# EAGLE design uav (EAGLE 5.07)
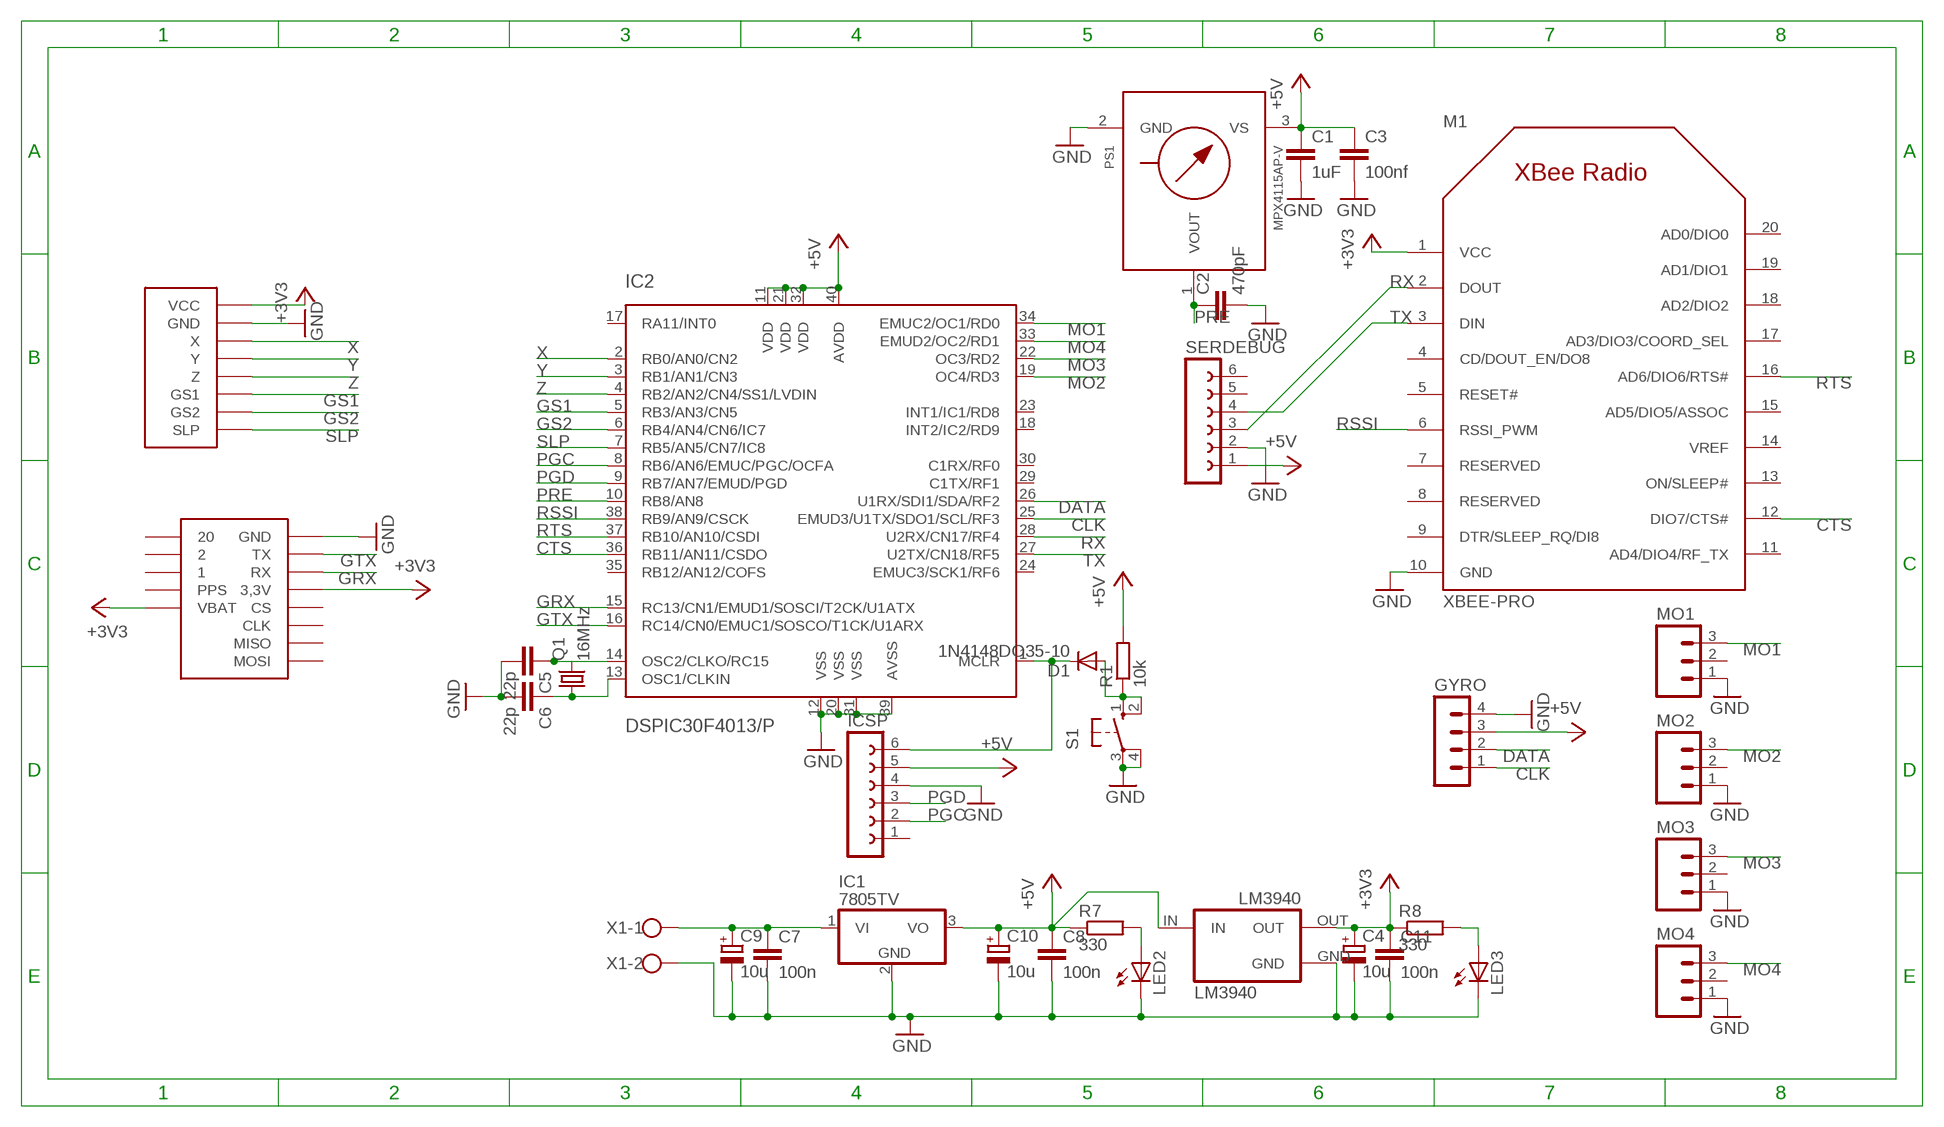
[diagram p0: schematic, sheet 1]

## Parts
C1  1uF  C-EU050-025X075  [C050-025X075]
C2  470pF  C-EU050-025X075  [C050-025X075]
C3  100nf  C-EU050-025X075  [C050-025X075]
C4  10u  CPOL-EUB45181B  [B45181B]
C5  22p  C-EU050-025X075  [C050-025X075]
C6  22p  C-EU050-025X075  [C050-025X075]
C7  100n  C-EU050-025X075  [C050-025X075]
C8  100n  C-EU050-025X075  [C050-025X075]
C9  10u  CPOL-EUB45181A  [B45181A]
C10  10u  CPOL-EUB45181A  [B45181A]
C11  100n  C-EU050-025X075  [C050-025X075]
D1  1N4148DO35-10  [DO35-10]
GYRO  MA04-1  [MA04-1]
IC1  7805TV  [TO220V]
IC2  DSPIC30F4013/P  [DIL40]
ICSP  FE06-1  [FE06]
LED2  LED3MM  [LED3MM]
LED3  LED3MM  [LED3MM]
LM3940  LM3940  [TO220(V)]
M1  XBEE-PRO  [XBEE-PRO]
MO1  M03  [03P]
MO2  M03  [03P]
MO3  M03  [03P]
MO4  M03  [03P]
PS1  MPX4115AP-V  [867B-V]
Q1  16MHz  CRYSTALHC49S  [HC49/S]
R1  10k  R-EU_0207/10  [0207/10]
R7  330  R-EU_0207/10  [0207/10]
R8  330  R-EU_0207/10  [0207/10]
S1  10-XX  [B3F-10XX]
SERDEBUG  FE06-1  [FE06]
U$1  ACCEL  [ACCEL]
U$2  GPS  [GPS]
X1  W237-102  [W237-102]

## Nets
+3V3: C4.+ C11.1 LM3940.OUT M1.1(VCC) R8.1 U$1.P$1(VCC) U$2.P$4(3,3V) U$2.P$13(VBAT)
+5V: C1.1 C3.1 C8.1 C10.+ GYRO.3 IC1.3(VO) IC2.11(VDD) IC2.21(VDD) IC2.32(VDD) IC2.40(AVDD) ICSP.5 LM3940.IN PS1.3(VS) R1.2 R7.1 SERDEBUG.1
CLK: GYRO.1 IC2.25(EMUD3/U1TX/SDO1/SCL/RF3)
CTS: IC2.36(RB11/AN11/CSDO) M1.12(DIO7/CTS#)
DATA: GYRO.2 IC2.26(U1RX/SDI1/SDA/RF2)
GND: C1.2 C2.2 C3.2 C4.- C5.2 C6.2 C7.2 C8.2 C9.- C10.- C11.2 GYRO.4 IC1.2(GND) IC2.12(VSS) IC2.20(VSS) IC2.31(VSS) IC2.39(AVSS) ICSP.4 LED2.K(C) LED3.K(C) LM3940.GND M1.10(GND) MO1.1 MO2.1 MO3.1 MO4.1 PS1.2(GND) S1.3(P) S1.4(P1) SERDEBUG.2 U$1.P$2(GND) U$2.P$1(GND) X1.2
GRX: IC2.15(RC13/CN1/EMUD1/SOSCI/T2CK/U1ATX) U$2.P$3(RX)
GS1: IC2.5(RB3/AN3/CN5) U$1.P$6(GS1)
GS2: IC2.6(RB4/AN4/CN6/IC7) U$1.P$7(GS2)
GTX: IC2.16(RC14/CN0/EMUC1/SOSCO/T1CK/U1ARX) U$2.P$2(TX)
MCLR: D1.C IC2.1(MCLR) ICSP.6
MO1: IC2.34(EMUC2/OC1/RD0) MO1.3
MO2: IC2.19(OC4/RD3) MO2.3
MO3: IC2.22(OC3/RD2) MO3.3
MO4: IC2.33(EMUD2/OC2/RD1) MO4.3
N$1: LED3.A R8.2
N$2: C5.1 IC2.14(OSC2/CLKO/RC15) Q1.2
N$4: C6.1 IC2.13(OSC1/CLKIN) Q1.1
N$7: C7.1 C9.+ IC1.1(VI) X1.1
N$9: D1.A R1.1 S1.1(S) S1.2(S1)
N$16: LED2.A R7.2
PGC: IC2.8(RB6/AN6/EMUC/PGC/OCFA) ICSP.2
PGD: IC2.9(RB7/AN7/EMUD/PGD) ICSP.3
PRE: C2.1 IC2.10(RB8/AN8) PS1.1(VOUT)
RSSI: IC2.38(RB9/AN9/CSCK) M1.6(RSSI_PWM)
RTS: IC2.37(RB10/AN10/CSDI) M1.16(AD6/DIO6/RTS#)
RX: IC2.28(U2RX/CN17/RF4) M1.2(DOUT) SERDEBUG.3
SLP: IC2.7(RB5/AN5/CN7/IC8) U$1.P$8(SLP)
TX: IC2.27(U2TX/CN18/RF5) M1.3(DIN) SERDEBUG.4
X: IC2.2(RB0/AN0/CN2) U$1.P$3(X)
Y: IC2.3(RB1/AN1/CN3) U$1.P$4(Y)
Z: IC2.4(RB2/AN2/CN4/SS1/LVDIN) U$1.P$5(Z)
Unconnected: IC2.17(RA11/INT0) IC2.18(INT2/IC2/RD9) IC2.23(INT1/IC1/RD8) IC2.24(EMUC3/SCK1/RF6) IC2.29(C1TX/RF1) IC2.30(C1RX/RF0) IC2.35(RB12/AN12/COFS) ICSP.1 M1.4(CD/DOUT_EN/DO8) M1.5(RESET#) M1.7(RESERVED) M1.8(RESERVED) M1.9(DTR/SLEEP_RQ/DI8) M1.11(AD4/DIO4/RF_TX) M1.13(ON/SLEEP#) M1.14(VREF) M1.15(AD5/DIO5/ASSOC) M1.17(AD3/DIO3/COORD_SEL) M1.18(AD2/DIO2) M1.19(AD1/DIO1) M1.20(AD0/DIO0) MO1.2 MO2.2 MO3.2 MO4.2 PS1.4(NC) PS1.5(NC) PS1.6(NC) SERDEBUG.5 SERDEBUG.6 U$2.P$5(CS) U$2.P$6(CLK) U$2.P$7(MISO) U$2.P$8(MOSI) U$2.P$9 U$2.P$10 U$2.P$11 U$2.P$12(PPS)

## Library data of the parts
C1-C3 C5-C8 C11 = rcl:C-EU: CAPACITOR, European symbol
C4 C9 C10 = rcl:CPOL-EU: POLARIZED CAPACITOR, European symbol
D1 = diode:1N4148: DIODE high speed (Philips)
GYRO = con-lstb:MA04-1: PIN HEADER
IC1 = linear:78*: Positive VOLTAGE REGULATOR Source: http://cache.national.com/ds/LM/LM78L05.pdf http://www.fairchildsemi.com/ds/LM/LM7805.pdf
IC2 = microchip-dspic:DSPIC30F4013: dsPIC General DSC with CAN and CoDec ports
ICSP SERDEBUG = con-lsta:FE06-1: FEMALE HEADER
LED2 LED3 = led:LED: LED OSRAM: - CHIPLED LG R971, LG N971, LY N971, LG Q971, LY Q971, LO R971, LY R971 LH N974, LH R974 LS Q976, LO Q976, LY Q976 LO Q996 - Hyper CHIPLED LW Q18S LB Q993, LB Q99A, LB R99A - SideLED LS A670, LO A670, LY A670, LG A670, LP A670 LB A673, LV A673, LT A673, LW A673 LH A674 LY A675 LS A676, LA A676, LO A676, LY A676, LW A676 LS A679, LY A679, LG A679 - Hyper Micro SIDELED® LS Y876, LA Y876, LO Y876, LY Y876 LT Y87S - SmartLED LW L88C, LW L88S LB L89C, LB L89S, LG L890 LS L89K, LO L89K, LY L89K LS L896, LA L896, LO L896, LY L896 - TOPLED LS T670, LO T670, LY T670, LG T670, LP T670 LSG T670, LSP T670, LSY T670, LOP T670, LYG T670 LG T671, LOG T671, LSG T671 LB T673, LV T673, LT T673, LW T673 LH T674 LS T676, LA T676, LO T676, LY T676, LB T676, LH T676, LSB T676, LW T676 LB T67C, LV T67C, LT T67C, LS T67K, LO T67K, LY T67K, LW E67C LS E67B, LA E67B, LO E67B, LY E67B, LB E67C, LV E67C, LT E67C LW T67C LS T679, LY T679, LG T679 LS T770, LO T770, LY T770, LG T770, LP T770 LB T773, LV T773, LT T773, LW T773 LH T774 LS E675, LA E675, LY E675, LS T675 LS T776, LA T776, LO T776, LY T776, LB T776 LHGB T686 LT T68C, LB T68C - Hyper Mini TOPLED® LB M676 - Mini TOPLED Santana® LG M470 LS M47K, LO M47K, LY M47K Source: http://www.osram.convergy.de LUXEON: - LUMILED® LXK2-PW12-R00, LXK2-PW12-S00, LXK2-PW14-U00, LXK2-PW14-V00 LXK2-PM12-R00, LXK2-PM12-S00, LXK2-PM14-U00 LXK2-PE12-Q00, LXK2-PE12-R00, LXK2-PE12-S00, LXK2-PE14-T00, LXK2-PE14-U00 LXK2-PB12-K00, LXK2-PB12-L00, LXK2-PB12-M00, LXK2-PB14-N00, LXK2-PB14-P00, LXK2-PB14-Q00 LXK2-PR12-L00, LXK2-PR12-M00, LXK2-PR14-Q00, LXK2-PR14-R00 LXK2-PD12-Q00, LXK2-PD12-R00, LXK2-PD12-S00 LXK2-PH12-R00, LXK2-PH12-S00 LXK2-PL12-P00, LXK2-PL12-Q00, LXK2-PL12-R00 Source: www.luxeon.com KINGBRIGHT: KA-3528ASYC Source: www.kingbright.com
LM3940 = lm2937:LM3940
M1 = xbee_r1:XBEE
MO1-MO4 = con-amp-quick:M03: AMP QUICK CONNECTOR
PS1 = mpx-freescale:MPX4115A: Integrated Silicon Pressure Sensor for Manifold Absolute Pressure, Altimeter or Barometer Applications On-Chip Signal Conditioned, Temperature Compensated and Calibrated INTEGRATED PRESSURE SENSOR 15 to 115 kPa (2.2 to 16.7 psi) 0.2 to 4.8 Volts Output
Q1 = crystal:CRYSTAL: CRYSTAL
R1 R7 R8 = rcl:R-EU_: RESISTOR, European symbol
S1 = switch-omron:10-XX: OMRON SWITCH
U$1 = module_library:ACCEL
U$2 = module_library:GPS
X1 = con-wago-500:W237-102: WAGO SCREW CLAMP

## Board
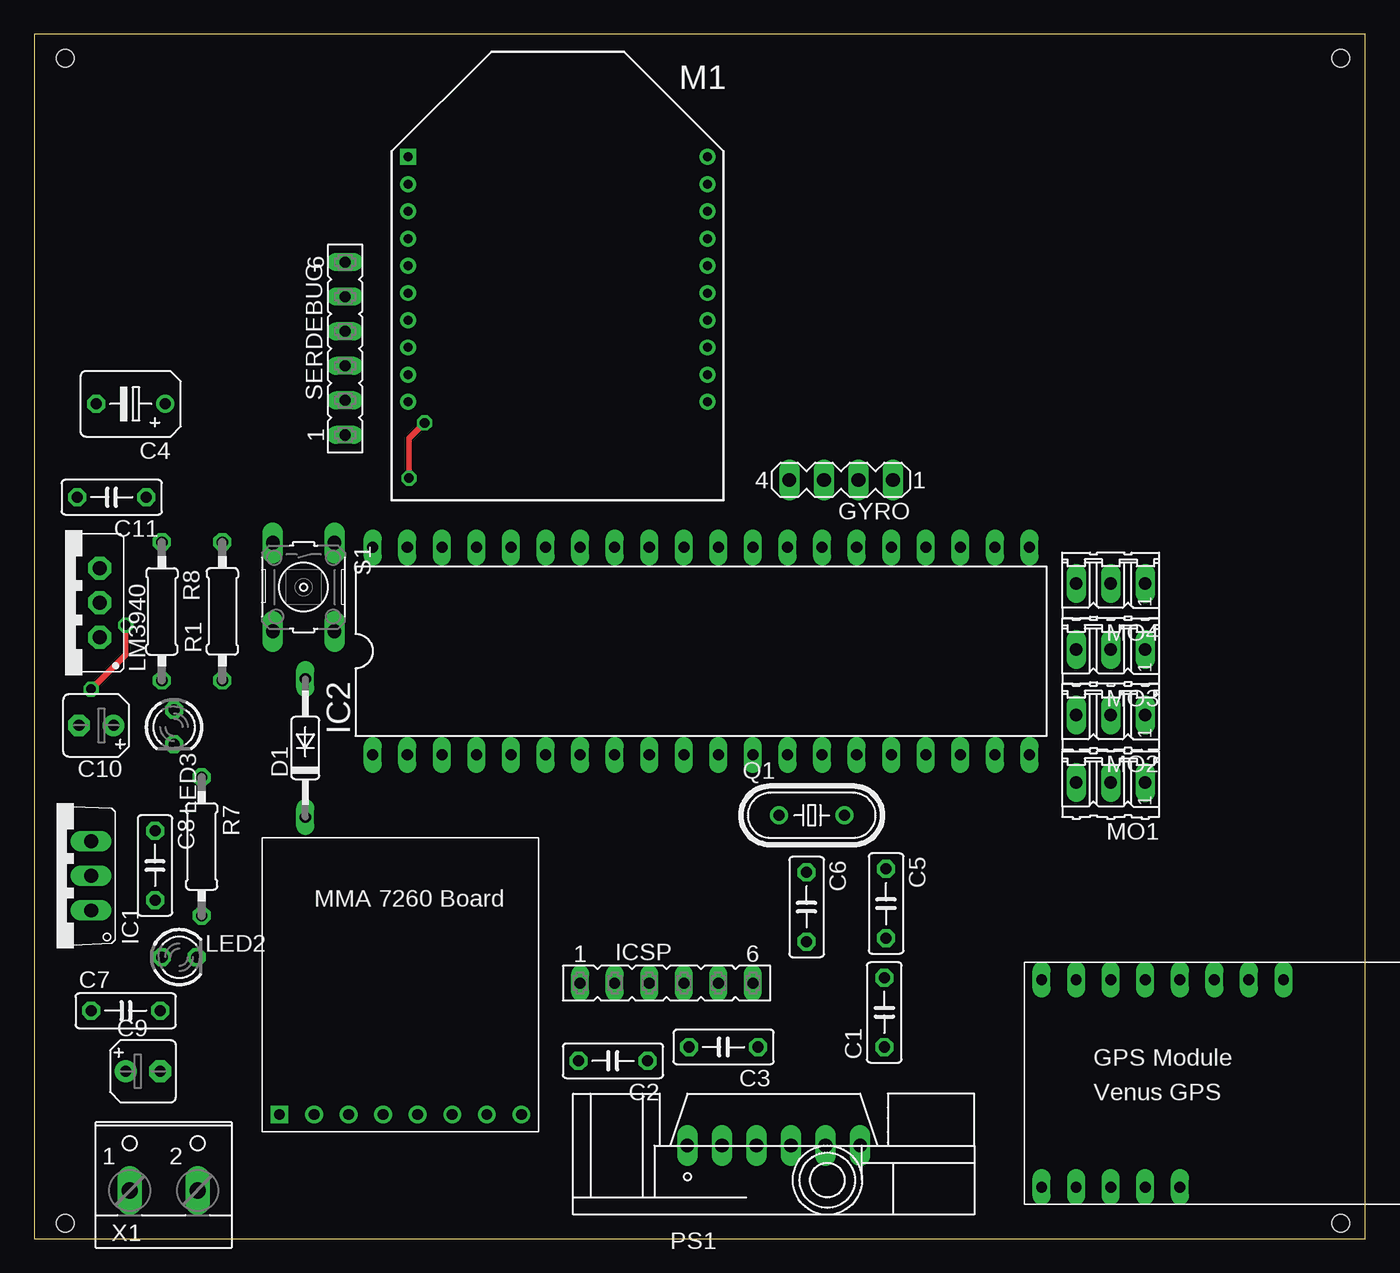
[diagram p1: board, top side]
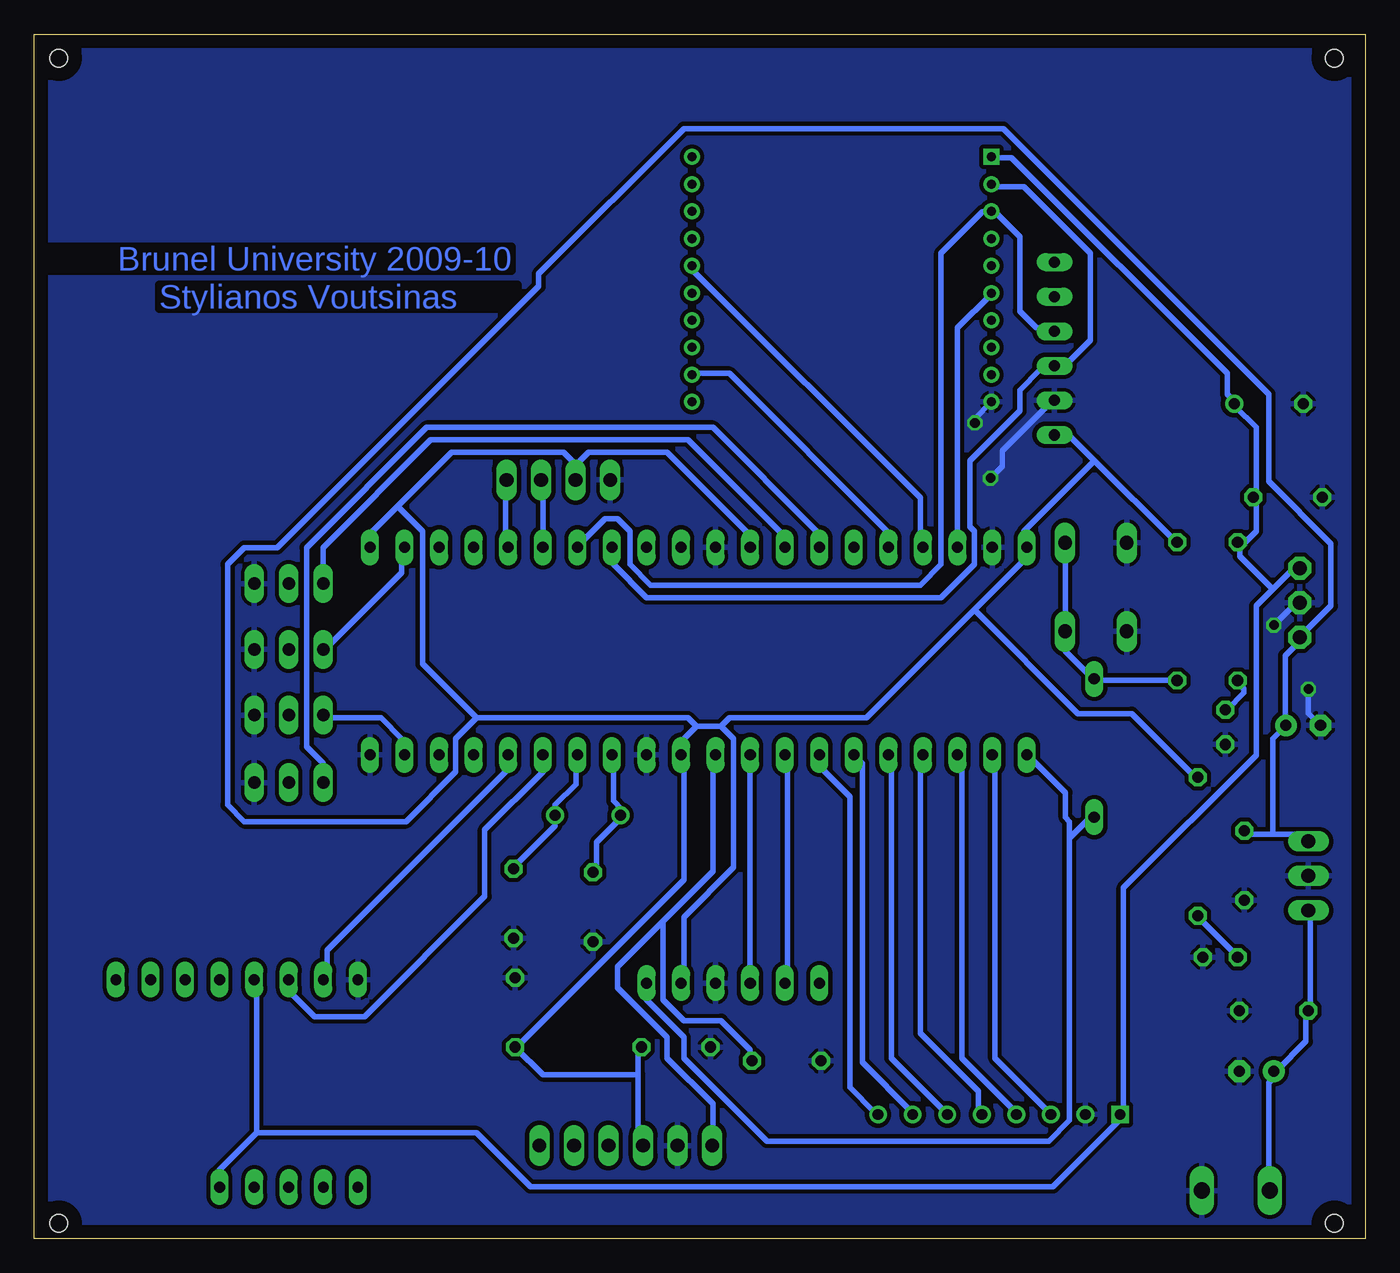
[diagram p2: board, bottom side, seen from below]

Size 97.84 x 88.51 mm. Coordinates in mm from the lower left corner, seen from the top.
Outline: 0,0 97.84,0 97.84,88.51 0,88.51 0,0
Copper layers (1*16): Top 0.035mm / dielectric 1.5mm / Bottom 0.035mm
Design rules "default *": minimum track width 16mil, minimum drill 24mil, track to track 12mil, track to pad 12mil, pad to pad 8mil, via to via 8mil, smd to smd 8mil, copper to edge 40mil, drill to drill 8mil, minimum pad ring 10mil, minimum via ring 8mil, stop-mask expansion 4mil, vias tented up to drill 0mil, thermal gap 10mil
Holes 1.3 mm at 2.29,86.74 2.29,1.14 96.01,86.74 96.01,1.14

### Footprints (pad centres in the part's own frame; a part is rotated, then mirrored left to right if it is on the bottom)
C050-025X075 = drill 0.813 octagon: 1 -2.54,0; 2 2.54,0
B45181B = drill 0.813 round: + -2.54,0 | drill 0.813 octagon: - 2.54,0
B45181A = drill 0.813 pad 1.6 round: + -1.27,0 | drill 0.813 pad 1.6 octagon: - 1.27,0
DO35-10 = drill 0.813 long: A 5.08,0; C -5.08,0
MA04-1 = drill 1.016 long: 1 -3.81,0; 2 -1.27,0; 3 1.27,0; 4 3.81,0
TO220V = drill 1.016 long: 1 -2.54,-2.54; 2 0,-2.54; 3 2.54,-2.54
DIL40 = drill 0.813 long: 1 -24.13,-7.62; 2 -21.59,-7.62; 3 -19.05,-7.62; 4 -16.51,-7.62; 5 -13.97,-7.62; 6 -11.43,-7.62; 7 -8.89,-7.62; 8 -6.35,-7.62; 9 -3.81,-7.62; 10 -1.27,-7.62; 11 1.27,-7.62; 12 3.81,-7.62; 13 6.35,-7.62; 14 8.89,-7.62; 15 11.43,-7.62; 16 13.97,-7.62; 17 16.51,-7.62; 18 19.05,-7.62; 19 21.59,-7.62; 20 24.13,-7.62; 21 24.13,7.62; 22 21.59,7.62; 23 19.05,7.62; 24 16.51,7.62; 25 13.97,7.62; 26 11.43,7.62; 27 8.89,7.62; 28 6.35,7.62; 29 3.81,7.62; 30 1.27,7.62; 31 -1.27,7.62; 32 -3.81,7.62; 33 -6.35,7.62; 34 -8.89,7.62; 35 -11.43,7.62; 36 -13.97,7.62; 37 -16.51,7.62; 38 -19.05,7.62; 39 -21.59,7.62; 40 -24.13,7.62
FE06 = drill 0.813 long: 1 -6.35,0; 2 -3.81,0; 3 -1.27,0; 4 1.27,0; 5 3.81,0; 6 6.35,0
LED3MM = drill 0.813 octagon: A -1.27,0; K 1.27,0
TO220(V) = drill 1.016 pad 1.676 octagon: GND 0,0; IN -2.54,0; OUT 2.54,0
XBEE-PRO = drill 0.66 square: 1 -11,9 | drill 0.66 round: 2 -11,7; 3 -11,5; 4 -11,3; 5 -11,1; 6 -11,-1; 7 -11,-3; 8 -11,-5; 9 -11,-7; 10 -11,-9; 11 11,-9; 12 11,-7; 13 11,-5; 14 11,-3; 15 11,-1; 16 11,1; 17 11,3; 18 11,5; 19 11,7; 20 11,9
03P = drill 0.914 long: 1 -2.54,0; 2 0,0; 3 2.54,0
867B-V = drill 1.016 long: 1 -6.35,0; 2 -3.81,0; 3 -1.27,0; 4 1.27,0; 5 3.81,0; 6 6.35,0
HC49/S = drill 0.813 round: 1 -2.413,0; 2 2.413,0
0207/10 = drill 0.813 octagon: 1 -5.08,0; 2 5.08,0
B3F-10XX = drill 1.016 long: 1 -3.251,2.261; 2 3.251,2.261; 3 -3.251,-2.261; 4 3.251,-2.261
ACCEL = drill 0.8 square: P$1 -15.24,8.89 | drill 0.8 round: P$2 -15.24,6.35; P$3 -15.24,3.81; P$4 -15.24,1.27; P$5 -15.24,-1.27; P$6 -15.24,-3.81; P$7 -15.24,-6.35; P$8 -15.24,-8.89
GPS = drill 0.8 long: P$1 -15.24,6.35; P$2 -12.7,6.35; P$3 -10.16,6.35; P$4 -7.62,6.35; P$5 -5.08,6.35; P$6 -2.54,6.35; P$7 0,6.35; P$8 2.54,6.35; P$9 -15.24,-8.89; P$10 -12.7,-8.89; P$11 -10.16,-8.89; P$12 -7.62,-8.89; P$13 -5.08,-8.89
W237-102 = drill 1.194 long: 1 -2.5,-1.27; 2 2.5,-1.27

### Placement (x,y rotation side)
C1  62.48,16.64 90 top
C2  42.55,13.08 180 top
C3  50.67,14.1 180 top
C4  7.11,61.34 180 top
C5  62.61,24.64 270 top
C6  56.77,24.38 270 top
C7  6.73,16.76 0 top
C8  8.89,27.43 270 top
C9  8,12.32 0 top
C10  4.57,37.72 180 top
C11  5.71,54.48 180 top
D1  19.94,36.07 90 top
GYRO  59.31,55.75 180 top
IC1  1.65,26.67 90 top
IC2  49.02,43.18 0 top
ICSP  46.48,18.8 0 top
LED2  10.67,20.7 0 top
LED3  10.29,37.59 270 top
LM3940  4.83,46.74 90 top
M1  38.48,70.48 0 top
MO1  79.12,33.53 180 top
MO2  79.12,38.48 180 top
MO3  79.12,43.31 180 top
MO4  79.12,48.13 180 top
PS1  54.36,6.86 0 top
Q1  57.15,31.12 0 top
R1  13.84,46.1 90 top
R7  12.32,28.83 270 top
R8  9.4,46.1 270 top
S1  19.81,47.88 270 top
SERDEBUG  22.86,65.41 90 top
U$1  26.92,24.38 90 top
U$2  89.28,12.7 0 top
X1  9.53,4.83 0 top

### Tracks (layer width: path | path; a pad name or v marks a point on that pad's centre or on a via)
+3V3
  Bottom 0.406: M1.1 27.23,79.43 26.01,79.43 10.16,63.58 10.16,62.05 9.55,61.44 C4.+ 9.55,61.14 8.03,59.61 8.03,54.74 C11.1 8.03,54.43 8.03,51.99 9.25,50.77 | 81.48,7.8 81.48,18.77 U$2.P$4 | 81.48,7.8 84.23,5.06 84.23,3.83 U$2.P$13 | 6.81,47.73 4.98,49.55 LM3940.OUT | 6.81,47.73 8.03,46.51 8.03,35.53 17.78,25.78 17.78,9.32 U$1.P$1 17.78,9.02 22.96,3.83 61.37,3.83 65.33,7.8 81.48,7.8 | 9.25,50.77 9.25,50.16 6.81,47.73 | 9.25,50.77 9.25,51.08 R8.1 9.25,50.77
+5V
  Bottom 0.406: 58.01,56.87 57.1,57.78 51.31,57.78 45.21,51.69 IC2.32 | 58.01,56.87 58.01,55.96 GYRO.3 58.01,56.87 | 71.12,53.82 67.16,57.78 58.93,57.78 58.01,56.87 | 71.12,53.82 72.95,51.99 72.95,51.08 IC2.21 | 6.81,29.74 4.67,29.74 4.37,29.44 IC1.3 | 6.81,29.74 8.64,29.74 C8.1 | 6.81,29.74 6.81,36.75 C10.+ 5.89,37.97 5.89,42.85 4.67,44.07 LM3940.IN 4.67,44.37 2.54,46.51 2.54,51.08 7.11,55.65 7.11,62.05 26.62,81.56 50.09,81.56 60.76,70.89 60.76,69.98 79.96,50.77 82.4,50.77 83.62,49.55 83.62,31.88 82.4,30.66 70.51,30.66 66.85,34.31 66.85,36.75 65.33,38.28 | 53.44,12.06 53.44,7.19 53.14,6.88 PS1.3 | 53.44,12.06 53.44,13.89 C3.1 | 53.44,12.06 60.45,12.06 C1.1 62.28,14.2 50.09,26.39 50.09,35.53 IC2.11 50.09,35.84 50.09,36.75 49.17,37.67 | 47.35,37.67 46.43,36.75 46.43,27.3 50.09,23.65 50.09,19.08 ICSP.5 | 49.17,37.67 47.35,37.67 | 65.33,38.28 49.78,38.28 49.17,37.67 | 71.12,53.82 69.29,51.99 69.29,42.24 65.33,38.28 | 28.75,46.2 36.68,38.28 46.74,38.28 47.35,37.67 | 28.75,46.2 25.09,49.86 25.09,50.77 IC2.40 25.09,51.08 25.09,51.99 19.91,57.17 | 19.91,57.17 21.74,59 22.66,59 SERDEBUG.1 | 19.91,57.17 14.12,51.38 R1.2 | 28.75,46.2 21.13,38.58 17.17,38.58 12.6,34.01 R7.1
CLK
  Bottom 0.406: IC2.25 63.2,51.08 63.2,55.65 GYRO.1
CTS
  Bottom 0.406: M1.12 49.48,63.58 46.74,63.58 35.15,51.99 35.15,51.08 IC2.36
DATA
  Bottom 0.406: IC2.26 60.45,55.65 GYRO.2
GND  (via drill 0.7)
  Top 0.406: v27.56,55.88 27.56,58.8 v28.7,59.94 | v6.73,45.09 6.73,42.93 v4.19,40.39
  Bottom 0.406: SERDEBUG.2 22.99,61.59 26.67,57.91 26.67,56.77 v27.56,55.88 | v28.7,59.94 28.7,60.26 M1.10 | LM3940.GND 5.08,46.74 v6.73,45.09 | v4.19,40.39 4.19,38.61 C10.-
  pour Bottom: 0.13,88.39 97.66,88.39 97.79,-0.13 0.25,-0.13
GRX
  Bottom 0.406: U$2.P$3 79.05,18.77 79.05,18.16 77.22,16.33 73.56,16.33 64.72,25.17 64.72,30.05 60.45,34.31 IC2.15
GS1
  Bottom 0.406: U$1.P$6 30.89,9.32 34.85,13.28 34.85,35.53 IC2.5
GS2
  Bottom 0.406: U$1.P$7 33.32,9.32 36.98,12.98 36.98,34.92 37.59,35.53 IC2.6
GTX
  Bottom 0.406: U$2.P$2 76.3,19.08 76.3,21.21 63.2,34.31 63.2,35.53 IC2.16
MCLR
  Bottom 0.406: IC2.1 24.79,35.53 22.05,32.79 22.05,30.96 21.74,30.66 21.74,29.44 | 21.74,29.44 21.74,8.71 23.27,7.19 43.99,7.19 50.09,13.28 50.09,14.81 52.83,17.55 ICSP.6 | 21.74,29.44 20.22,30.96 D1.C
MO1
  Bottom 0.406: IC2.34 40.34,51.08 40.34,51.99 47.95,59.61 68.99,59.61 77.83,50.77 77.83,36.14 76.61,34.92 76.61,33.71 MO1.3
MO2
  Bottom 0.406: IC2.19 70.82,35.84 70.82,36.75 72.34,38.28 76.3,38.28 MO2.3
MO3
  Bottom 0.406: IC2.22 70.82,50.77 70.82,48.95 76.3,43.46 MO3.3
MO4
  Bottom 0.406: IC2.33 42.77,51.08 42.77,51.69 49.78,58.7 68.68,58.7 76.61,50.77 76.61,48.34 MO4.3
N$1
  Bottom 0.406: LED3.A 10.16,38.89 8.94,40.11 8.94,40.41 9.55,41.02 R8.2
N$2
  Bottom 0.406: C5.1 62.59,27.3 59.54,30.35 59.54,30.96 Q1.2 59.54,31.27 59.54,31.88 58.01,33.4 58.01,35.53 IC2.14
N$4
  Bottom 0.406: C6.1 56.49,27 56.49,29.13 54.66,30.96 Q1.1 54.66,31.27 54.66,31.57 55.27,32.18 55.27,35.53 IC2.13
N$7
  Bottom 0.406: IC1.1 4.06,23.95 4.06,16.94 C7.1 4.37,16.64 4.37,14.5 6.5,12.37 C9.+ 6.5,12.06 7.11,11.46 7.11,3.83 X1.1
N$9
  Bottom 0.406: S1.1 22.05,51.08 22.05,44.68 S1.2 22.05,44.37 22.05,43.15 20.22,41.33 D1.A 19.91,41.02 R1.1
N$16
  Bottom 0.406: LED2.A 9.55,20.9 12.29,23.65 R7.2
PGC
  Bottom 0.406: ICSP.2 42.47,19.08 42.47,35.53 IC2.8
PGD
  Bottom 0.406: ICSP.3 IC2.9
PRE
  Bottom 0.406: 51.61,23.34 51.61,17.55 50.09,16.03 47.35,16.03 45.21,13.89 45.21,13.28 C2.1 | 51.61,23.34 47.95,27 47.95,35.53 IC2.10 | 51.61,23.34 54.97,19.99 54.97,18.47 51.31,14.81 51.31,13.28 47.95,9.93 47.95,6.88 PS1.1
RSSI
  Bottom 0.406: M1.6 27.53,69.37 29.97,66.93 IC2.38
RTS
  Bottom 0.406: M1.16 49.48,71.2 32.72,54.43 32.72,51.08 IC2.37
RX
  Bottom 0.406: M1.2 27.23,77.29 25.09,77.29 20.22,72.42 20.22,66.02 22.05,64.19 22.66,64.19 SERDEBUG.3 22.96,63.88 23.88,63.88 25.4,62.36 25.4,60.83 29.06,57.17 29.06,52.3 28.75,51.99 28.75,49.55 31.19,47.12 52.83,47.12 55.27,49.55 55.27,50.77 IC2.28
SLP
  Bottom 0.406: U$1.P$8 36.07,9.32 37.9,11.15 37.9,32.49 40.03,34.62 40.03,35.53 IC2.7
TX
  Bottom 0.406: SERDEBUG.4 22.96,66.93 24.18,66.93 25.4,68.15 25.4,73.64 27.23,75.46 M1.3 27.53,75.46 28.14,75.46 31.19,72.42 31.19,49.55 32.72,48.03 52.53,48.03 54.05,49.55 54.05,51.99 54.97,52.91 55.88,52.91 57.71,51.08 IC2.27
X
  Bottom 0.406: U$1.P$3 23.27,9.32 27.23,13.28 27.23,35.53 IC2.2
Y
  Bottom 0.406: U$1.P$4 25.7,9.32 29.67,13.28 29.67,35.23 29.97,35.53 IC2.3
Z
  Bottom 0.406: U$1.P$5 28.45,9.32 28.45,10.85 32.72,15.11 32.72,35.53 IC2.4

### Text on the board
Bottom: Brunel University 2009-10 | Stylianos Voutsinas